# Altium schematic sheet Clock.SchDoc
size Tabloid; DocumentNumber: 4; SheetNumber: 4; SheetTotal: 11; SheetName: Clock; ProjectTitle: 16SoundsUSB; Size: 11x17; Sheet_Name: Clock
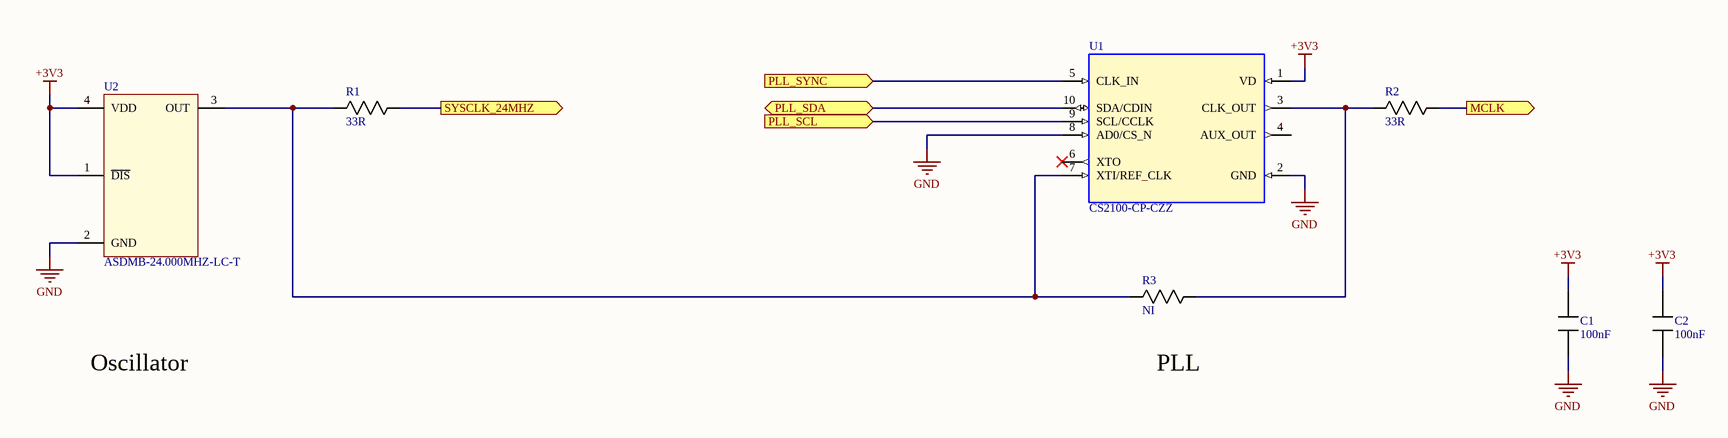
[diagram p0: Clock.SchDoc]

## Parts
C1  value 100nF  [0603]  (hidden comment: Capacitor)
C2  value 100nF  [0603]  (hidden comment: Capacitor)
R1  value 33R  [0603]  (hidden comment: Resistor)
R2  value 33R  [0603]  (hidden comment: Resistor)
R3  Resistor  [0603]  (value not drawn)
U1  Mfg_PN: CS2100-CP-CZZ  [MSOP10]  (hidden comment: CS2100_CP)
U2  Mfg_PN: ASDMB-24.000MHZ-LC-T  [OSC_ADSMB]  (hidden comment: OSC_ASDMB)

## Ports
MCLK (out), PLL_SCL (in), PLL_SDA (bidir), PLL_SYNC (in), SYSCLK_24MHZ (out)

## Nets
+3V3: C1.1 C2.1 U1.1(VD) U2.1(~{DIS}) U2.4(VDD)
GND: C1.2 C2.2 U1.2(GND) U1.8(AD0/CS_N) U2.2(GND)
MCLK: R2.2 ; port MCLK
PLL_SCL: U1.9(SCL/CCLK) ; port PLL_SCL
PLL_SDA: U1.10(SDA/CDIN) ; port PLL_SDA
PLL_SYNC: U1.5(CLK_IN) ; port PLL_SYNC
SYSCLK_24MHZ: R1.2 ; port SYSCLK_24MHZ
NetR1_1: R1.1 R3.1 U1.7(XTI/REF_CLK) U2.3(OUT)
NetR2_1: R2.1 R3.2 U1.3(CLK_OUT)

Not connected (* = marked no-connect by the designer): U1 4(AUX_OUT) 6(XTO)*

## Notes on the sheet
- Oscillator
- PLL
- Sheet Name
- Project Title
- Size
- Group
- Revision
- Date :
- Filename :
- Sheet
- Authors :
- of

## Library data of the parts
C1 C2 = Capacitor: Mfg: Samsung; Mfg_PN: CL10F104ZO8NNNC; HelpURL: *; NI: *; Supplier1: Digikey; Supplier1_PN: 1276-1258-1-ND; Tolerance: *; Type: *; Rating: *
R1 R2 = Resistor: Mfg: Yageo; Mfg_PN: RC0603JR-0733RL; HelpURL: *; NI: *; Supplier1: Digikey; Supplier1_PN: 311-33GRCT-ND; Type: *; Rating: *; Tolerance: *
R3 = Resistor: Value: 0R; HelpURL: *; Mfg: *; Mfg_PN: *; NI: NI; Supplier1: *; Supplier1_PN: *; Type: *; Rating: *; Tolerance: *
U1 = CS2100_CP: Fractional-N Clock Multiplier, Crystal Reference, MSOP10; Mfg: Cirrus Logic; Supplier1: Digikey; Supplier1_PN: 598-1750-ND
U2 = OSC_ASDMB: Oscillator; 1V8 to 3V3; Mfg: Abracon; HelpURL: http://www.abracon.com/Oscillators/ASDMB.pdf; Supplier1: Digikey; Supplier1_PN: 535-11728-1-ND; NI: *; Type: 24MHz